# Altium project PCB_SCH-MAKEY_MAKEY_PTITTEAM.PrjPcb
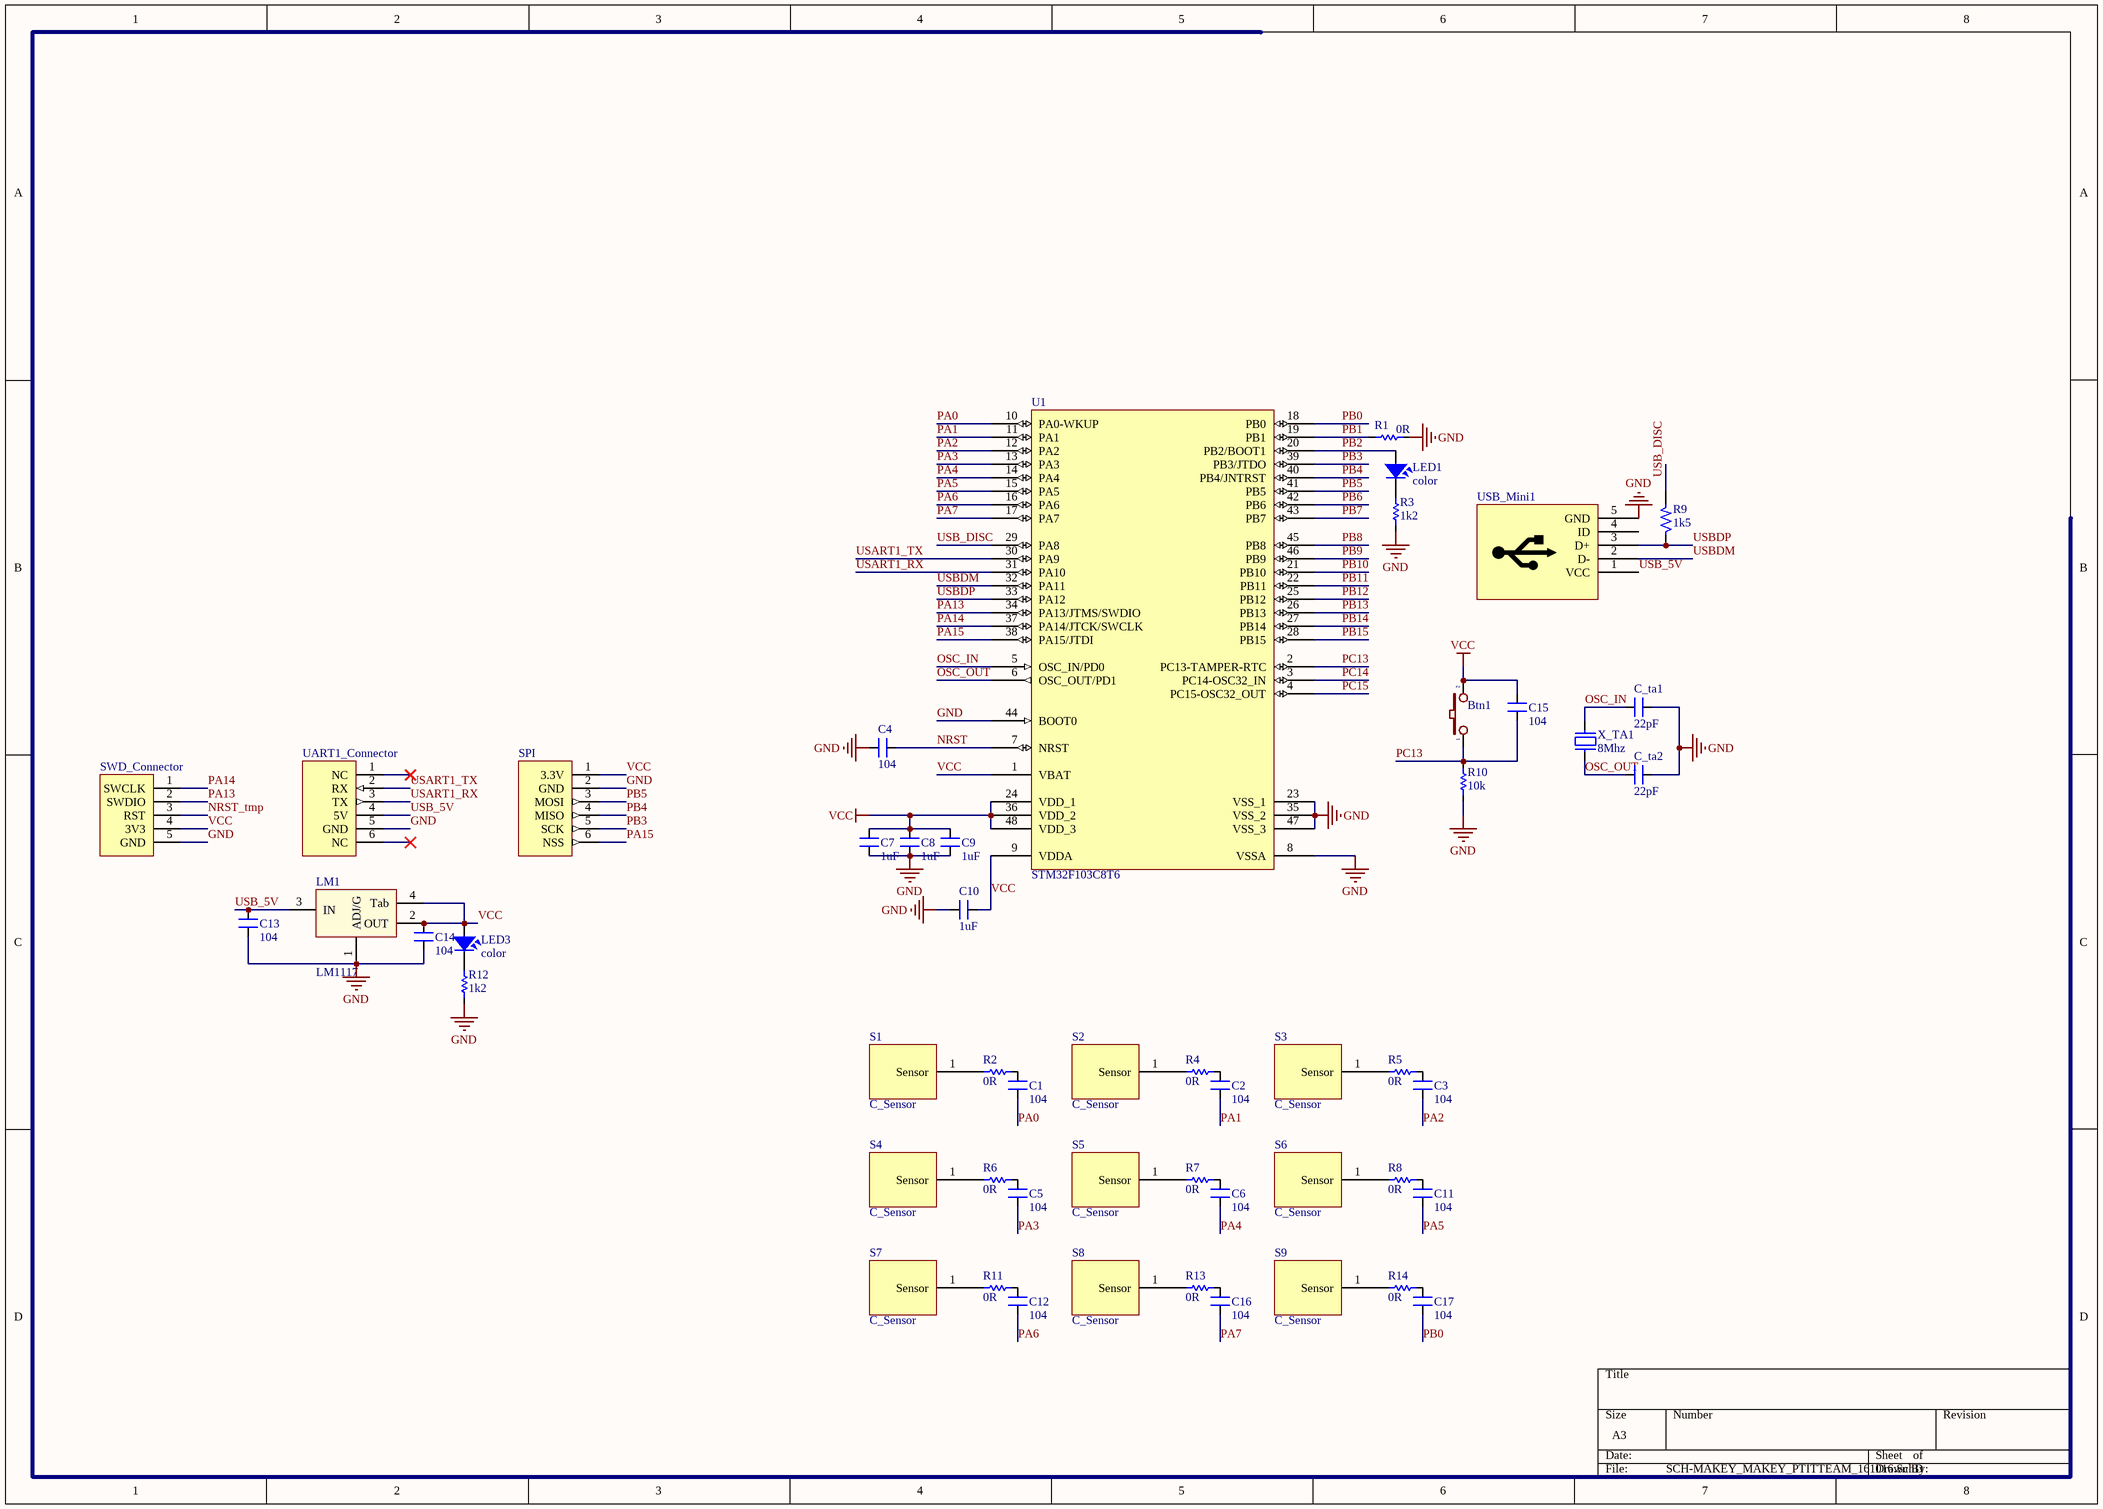
[diagram p0: SCH-MAKEY_MAKEY_PTITTEAM_161016.SchDoc]
1 sheet, 52 parts. Net scope: global (net labels, ports and power ports of the same name join across sheets).
Board file: PCB-MAKEY_MAKEY_PTITTEAM_v1.8.PcbDoc

## Sheet SCH-MAKEY_MAKEY_PTITTEAM_161016.SchDoc
size A3

### Parts
Btn1  Function  [Button_SMD_2pin]  (value not drawn)
C1  104  [CAP-0603]
C2  104  [CAP-0603]
C3  104  [CAP-0603]
C4  104  [CAP-0603]
C5  104  [CAP-0603]
C6  104  [CAP-0603]
C7  1uF  [CAP-0603]
C8  1uF  [CAP-0603]
C9  1uF  [CAP-0603]
C10  1uF  [CAP-0603]
C11  104  [CAP-0603]
C12  104  [CAP-0603]
C13  104  [CAP-0603]
C14  104  [CAP-0603]
C15  104  [CAP-0603]
C16  104  [CAP-0603]
C17  104  [CAP-0603]
C_ta1  22pF  [CAP-0603]
C_ta2  22pF  [CAP-0603]
LED1  color  [LED-0805]
LED3  color  [LED-0805]
LM1  LM1117  [SOT223-4N]
R1  0R  [RES-0603]
R2  0R  [RES-0603]
R3  1k2  [RES-0603]
R4  0R  [RES-0603]
R5  0R  [RES-0603]
R6  0R  [RES-0603]
R7  0R  [RES-0603]
R8  0R  [RES-0603]
R9  1k5  [RES-0603]
R10  10k  [RES-0603]
R11  0R  [RES-0603]
R12  1k2  [RES-0603]
R13  0R  [RES-0603]
R14  0R  [RES-0603]
S1  C_Sensor  [SOP2]
S2  C_Sensor  [SOP2]
S3  C_Sensor  [SOP2]
S4  C_Sensor  [SOP2]
S5  C_Sensor  [SOP2]
S6  C_Sensor  [SOP2]
S7  C_Sensor  [SOP2]
S8  C_Sensor  [SOP2]
S9  C_Sensor  [SOP2]
SPI  (no value)  [JP6]
SWD_Connector  (no value)  [JP_5]
U1  STM32F103C8T6  [LQFP48_N]
UART1_Connector  Connector  [JP6]  (value not drawn)
USB_Mini1  (no value)  [Micro_USB]
X_TA1  8Mhz  [XT2]

### Nets
GND: C4.2 C7.1 C8.2 C9.1 C10.2 C13.1 C14.1 C_ta1.2 C_ta2.2 LM1.1(ADJ/G) R1.1 R3.1 R10.1 R12.1 SPI.2(GND) SWD_Connector.5(GND) U1.8(VSSA) U1.23(VSS_1) U1.35(VSS_2) U1.44(BOOT0) U1.47(VSS_3) UART1_Connector.5(GND) USB_Mini1.5(GND)
VCC: Btn1.2 C7.2 C8.1 C9.2 C10.1 C14.2 C15.2 LED3.1 LM1.2(OUT) LM1.4(Tab) SPI.1(3.3V) SWD_Connector.4(3V3) U1.1(VBAT) U1.9(VDDA) U1.24(VDD_1) U1.36(VDD_2) U1.48(VDD_3)
NRST: C4.1 U1.7(NRST)
NRST_tmp: SWD_Connector.3(RST)
OSC_IN: C_ta1.1 U1.5(OSC_IN/PD0) X_TA1.2
OSC_OUT: C_ta2.1 U1.6(OSC_OUT/PD1) X_TA1.1
PA0: C1.1 U1.10(PA0-WKUP)
PA1: C2.1 U1.11(PA1)
PA2: C3.1 U1.12(PA2)
PA3: C5.1 U1.13(PA3)
PA4: C6.1 U1.14(PA4)
PA5: C11.1 U1.15(PA5)
PA6: C12.1 U1.16(PA6)
PA7: C16.1 U1.17(PA7)
PA13: SWD_Connector.2(SWDIO) U1.34(PA13/JTMS/SWDIO)
PA14: SWD_Connector.1(SWCLK) U1.37(PA14/JTCK/SWCLK)
PA15: SPI.6(NSS) U1.38(PA15/JTDI)
PB0: C17.1 U1.18(PB0)
PB1: R1.2 U1.19(PB1)
PB2: LED1.1 U1.20(PB2/BOOT1)
PB3: SPI.5(SCK) U1.39(PB3/JTDO)
PB4: SPI.4(MISO) U1.40(PB4/JNTRST)
PB5: SPI.3(MOSI) U1.41(PB5)
PB6: U1.42(PB6)
PB7: U1.43(PB7)
PB8: U1.45(PB8)
PB9: U1.46(PB9)
PB10: U1.21(PB10)
PB11: U1.22(PB11)
PB12: U1.25(PB12)
PB13: U1.26(PB13)
PB14: U1.27(PB14)
PB15: U1.28(PB15)
PC13: Btn1.1 C15.1 R10.2 U1.2(PC13-TAMPER-RTC)
PC14: U1.3(PC14-OSC32_IN)
PC15: U1.4(PC15-OSC32_OUT)
USART1_RX: U1.31(PA10) UART1_Connector.3(TX)
USART1_TX: U1.30(PA9) UART1_Connector.2(RX)
USB_5V: C13.2 LM1.3(IN) UART1_Connector.4(5V) USB_Mini1.1(VCC)
USB_DISC: R9.2 U1.29(PA8)
USBDM: U1.32(PA11) USB_Mini1.2(D-)
USBDP: R9.1 U1.33(PA12) USB_Mini1.3(D+)
NetC1_2: C1.2 R2.1
NetC2_2: C2.2 R4.1
NetC3_2: C3.2 R5.1
NetC5_2: C5.2 R6.1
NetC6_2: C6.2 R7.1
NetC11_2: C11.2 R8.1
NetC12_2: C12.2 R11.1
NetC16_2: C16.2 R13.1
NetC17_2: C17.2 R14.1
NetLED1_2: LED1.2 R3.2
NetLED3_2: LED3.2 R12.2
NetR2_2: R2.2 S1.1(Sensor)
NetR4_2: R4.2 S2.1(Sensor)
NetR5_2: R5.2 S3.1(Sensor)
NetR6_2: R6.2 S4.1(Sensor)
NetR7_2: R7.2 S5.1(Sensor)
NetR8_2: R8.2 S6.1(Sensor)
NetR11_2: R11.2 S7.1(Sensor)
NetR13_2: R13.2 S8.1(Sensor)
NetR14_2: R14.2 S9.1(Sensor)

Not connected (* = marked no-connect by the designer): UART1_Connector 1(NC)* 6(NC)*; USB_Mini1 4(ID)

### Library data of the parts
Btn1 = Button_SMD_2pin: Switch button 2 pin; Value: SW chip 2 pin
C1-C6 C9-C11 C13-C15 = CM: Cap SMD; Value: 103
C7 C8 C12 C16 C17 C_ta1 C_ta2 = CN0: Cremic For Xtal 1pF => 100pF; Value: 33pF
LED1 LED3 = Led_SMD: Led smd
LM1 = LM1117: 3v3; Value: LM317
R1-R8 R10-R14 = Res_SMD_0603: Resistor smd 0603 type
R9 = R: Resistor 1/4W; Value: R1/4W - 1K
SPI = SPI_Connector
SWD_Connector = Load_Program
U1 = STM32F103C8T6: STM32 ARM-based 32-bit MCU with 64 Kbytes Flash, 48-pin LQFP, Industrial Temperature; Published: 30-May-2008; DatasheetVersion: rev6, Mar-2008; PackageVersion: Mar-2008; PackageReference: LQFP48; Publisher: Altium Limited; PackageDescription: 48-Pin Low-Profile Quad Flat Pack, 7 x 7 mm Body, 0.5 mm Pitch (LQFP48); ComponentLink1Description: Manufacturer Link; ComponentLink1URL: www.st.com/stm32; ComponentLink2Description: Datasheet; ComponentLink2URL: http://www.st.com/stonline/products/literature/ds/13587.pdf
UART1_Connector = USB2Com_Conn: Connector to USB2Com module
USB_Mini1 = USB_M
X_TA1 = XT2: Crystal For all Crystal 2pin.; Value: 4Mhz